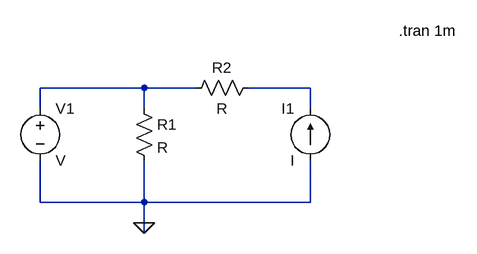
[diagram p0: schematic Q2-3 blank.asc]
Q2-3 blank.asc, the LTspice schematic file:
Version 4.1
SHEET 1 880 680
WIRE 144 112 -16 112
WIRE 224 112 144 112
WIRE 400 112 304 112
WIRE -16 144 -16 112
WIRE 144 144 144 112
WIRE 400 144 400 112
WIRE -16 288 -16 224
WIRE 144 288 144 224
WIRE 144 288 -16 288
WIRE 400 288 400 224
WIRE 400 288 144 288
WIRE 144 320 144 288
WIRE 144 336 144 320
FLAG 144 320 0
SYMBOL res 128 128 R0
SYMATTR InstName R1
SYMBOL res 320 96 R90
WINDOW 0 0 56 VBottom 2
WINDOW 3 32 56 VTop 2
SYMATTR InstName R2
SYMBOL voltage -16 128 R0
SYMATTR InstName V1
SYMBOL current 400 224 R180
WINDOW 0 24 80 Left 2
WINDOW 3 24 0 Left 2
SYMATTR InstName I1
TEXT 536 24 Left 2 !.tran 1m

The netlist it stands for:
* Q2-3 blank.asc
R1 N001 0 R
R2 N002 N001 R
V1 N001 0 V
I1 0 N002 I
.tran 1m
.backanno
.end